# Altium schematic sheet 3_IO.SchDoc
size A3; SheetNumber: 4; SheetTotal: 13
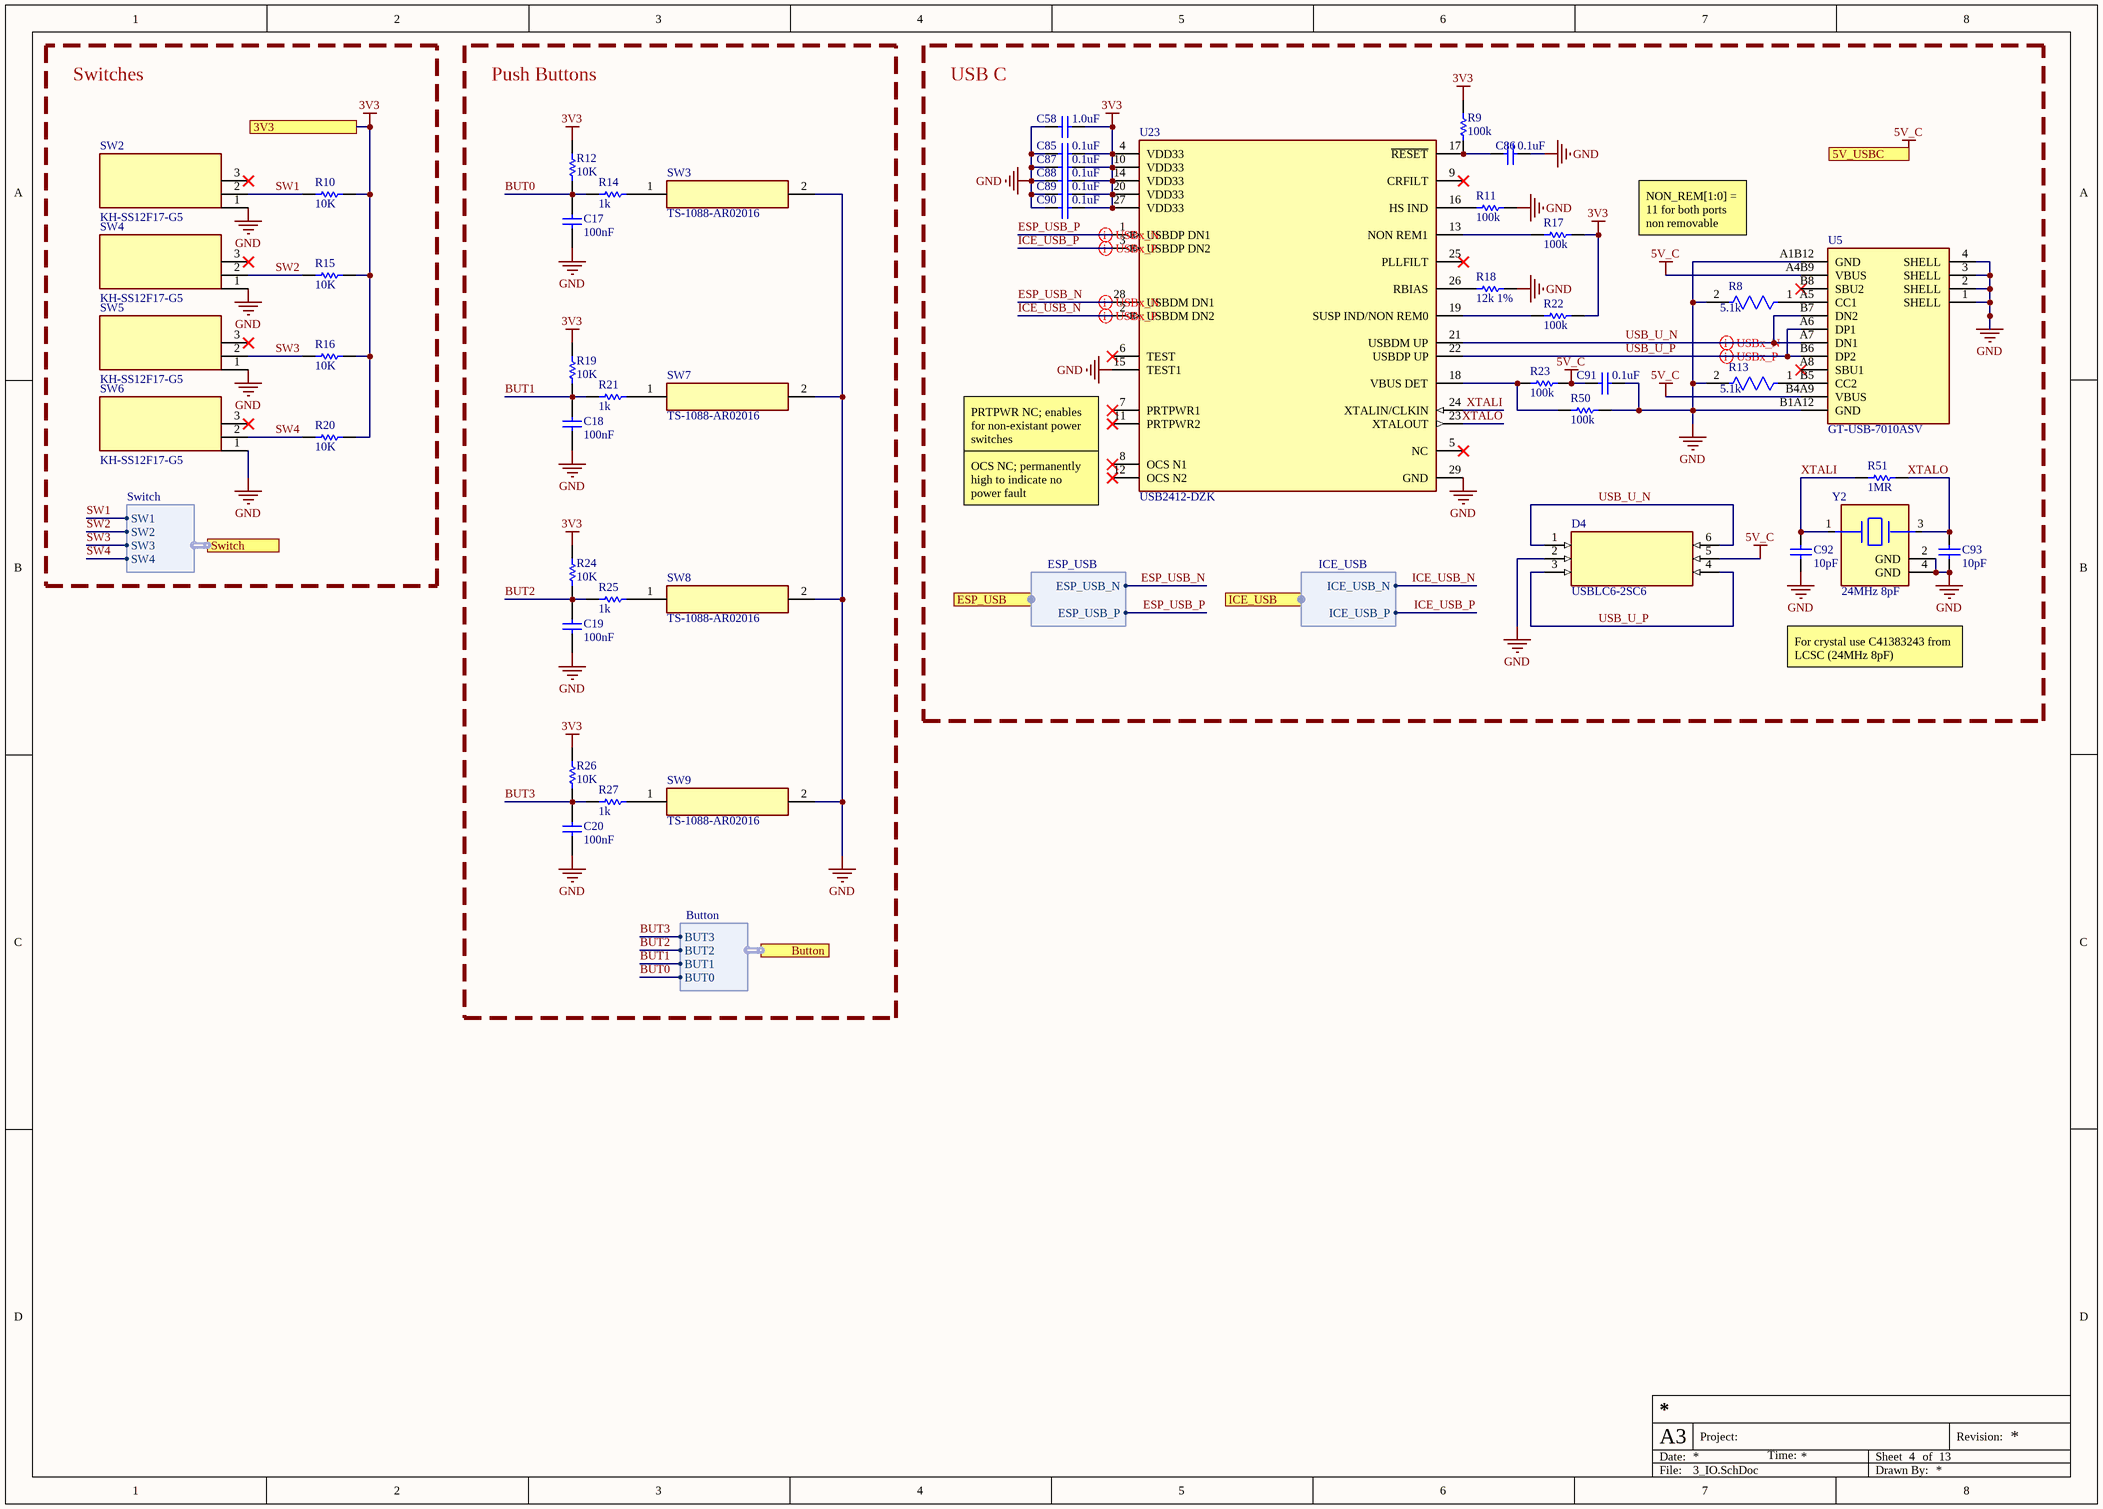
[diagram p0: 3_IO.SchDoc]

## Parts
C17  value 100nF  [CAP0603R]  (hidden comment: EMF107B7104KAHT)
C18  value 100nF  [CAP0603R]  (hidden comment: EMF107B7104KAHT)
C19  value 100nF  [CAP0603R]  (hidden comment: EMF107B7104KAHT)
C20  value 100nF  [CAP0603R]  (hidden comment: EMF107B7104KAHT)
C58  1.0uF  [CAPC1608X90X35ML15T15]
C85  0.1uF  [CAPC1608X90X35ML15T15]
C86  0.1uF  [CAPC1608X90X35ML15T15]
C87  0.1uF  [CAPC1608X90X35ML15T15]
C88  0.1uF  [CAPC1608X90X35ML15T15]
C89  0.1uF  [CAPC1608X90X35ML15T15]
C90  0.1uF  [CAPC1608X90X35ML15T15]
C91  0.1uF  [CAPC1608X90X35ML15T15]
C92  10pF  [CAPC1608X90X35ML15T15]
C93  10pF  [CAPC1608X90X35ML15T15]
D4  USBLC6-2SC6  [SOT-23-6_L2.9-W1.6-P0.95-LS2.8-BL]
R8  5.1k  [FP-MCT0603-IPC_B]
R9  100k  [RESC1609X55X30NL10T20]
R10  10K  [RESC1609X55X30NL10T20]
R11  100k  [RESC1609X55X30NL10T20]
R12  10K  [RESC1609X55X30NL10T20]
R13  5.1k  [FP-MCT0603-IPC_B]
R14  1k  [RESC1609X55X30NL10T20]
R15  10K  [RESC1609X55X30NL10T20]
R16  10K  [RESC1609X55X30NL10T20]
R17  100k  [RESC1609X55X30NL10T20]
R18  12k 1%  [RESC1609X55X30NL10T20]
R19  10K  [RESC1609X55X30NL10T20]
R20  10K  [RESC1609X55X30NL10T20]
R21  1k  [RESC1609X55X30NL10T20]
R22  100k  [RESC1609X55X30NL10T20]
R23  100k  [RESC1609X55X30NL10T20]
R24  10K  [RESC1609X55X30NL10T20]
R25  1k  [RESC1609X55X30NL10T20]
R26  10K  [RESC1609X55X30NL10T20]
R27  1k  [RESC1609X55X30NL10T20]
R50  100k  [RESC1609X55X30NL10T20]
R51  1MR  [RESC1609X55X30NL10T20]
SW2  KH-SS12F17-G5  [SW-TH_KH-SS12F17-G5]
SW3  TS-1088-AR02016  [SW-SMD_L3.9-W3.0-P4.45]
SW4  KH-SS12F17-G5  [SW-TH_KH-SS12F17-G5]
SW5  KH-SS12F17-G5  [SW-TH_KH-SS12F17-G5]
SW6  KH-SS12F17-G5  [SW-TH_KH-SS12F17-G5]
SW7  TS-1088-AR02016  [SW-SMD_L3.9-W3.0-P4.45]
SW8  TS-1088-AR02016  [SW-SMD_L3.9-W3.0-P4.45]
SW9  TS-1088-AR02016  [SW-SMD_L3.9-W3.0-P4.45]
U5  GT-USB-7010ASV  [USB-C-SMD_G-SWITCH_GT-USB-7010ASV]
U23  USB2412-DZK  [FP-USB2412-DZK-MFG]
Y2  24MHz 8pF  [FP-TSX-3225-MFG]

## Blocks framed on the sheet
Switches: R10 R15 R16 R20 SW2 SW4-SW6
Push Buttons: C17-C20 R12 R14 R19 R21 R24-R27 SW3 SW7-SW9
USB C: C58 C85-C93 D4 R8 R9 R11 R13 R17 R18 R22 R23 R50 R51 U5 U23 Y2

## Ports
3V3, 5V_USBC, Button (harness Button), ESP_USB (harness ESP_USB), ICE_USB (harness ICE_USB), Switch (harness Switch)

## Harnesses
Switch: SW1, SW2, SW3, SW4
Button: BUT0, BUT2, BUT3, BUT1
ICE_USB: ICE_USB_N, ICE_USB_P
ESP_USB: ESP_USB_N, ESP_USB_P

## Nets
3V3: C58.1 C85.1 C87.1 C88.1 C89.1 C90.1 R9.2 R10.1 R12.2 R15.1 R16.1 R17.1 R19.2 R20.1 R22.1 R24.2 R26.2 U23.4(VDD33) U23.10(VDD33) U23.14(VDD33) U23.20(VDD33) U23.27(VDD33) ; port 3V3
5V_C: C91.2 D4.5 R23.1 U5.A4B9(VBUS) U5.B4A9(VBUS) ; port 5V_USBC
GND: C17.1 C18.1 C19.1 C20.1 C58.2 C85.2 C86.1 C87.2 C88.2 C89.2 C90.2 C91.1 C92.2 C93.2 D4.2 R8.2 R11.1 R13.2 R18.1 R50.1 SW2.1 SW3.2 SW4.1 SW5.1 SW6.1 SW7.2 SW8.2 SW9.2 U5.1(SHELL) U5.2(SHELL) U5.3(SHELL) U5.4(SHELL) U5.A1B12(GND) U5.B1A12(GND) U23.15(TEST1) U23.29(GND) Y2.2(GND) Y2.4(GND)
BUT0: C17.2 R12.1 R14.2 ; port Button.BUT0
BUT1: C18.2 R19.1 R21.2 ; port Button.BUT1
BUT2: C19.2 R24.1 R25.2 ; port Button.BUT2
BUT3: C20.2 R26.1 R27.2 ; port Button.BUT3
ESP_USB_N: U23.28(USBDM_DN1) ; port ESP_USB.ESP_USB_N
ESP_USB_P: U23.1(USBDP_DN1) ; port ESP_USB.ESP_USB_P
ICE_USB_N: U23.2(USBDM_DN2) ; port ICE_USB.ICE_USB_N
ICE_USB_P: U23.3(USBDP_DN2) ; port ICE_USB.ICE_USB_P
SW1: R10.2 SW2.2 ; port Switch.SW1
SW2: R15.2 SW4.2 ; port Switch.SW2
SW3: R16.2 SW5.2 ; port Switch.SW3
SW4: R20.2 SW6.2 ; port Switch.SW4
USB_U_N: D4.1 D4.6 U5.A7(DN1) U5.B7(DN2) U23.21(USBDM_UP)
USB_U_P: D4.3 D4.4 U5.A6(DP1) U5.B6(DP2) U23.22(USBDP_UP)
XTALI: C92.1 R51.2 U23.24(XTALIN/CLKIN) Y2.1
XTALO: C93.1 R51.1 U23.23(XTALOUT) Y2.3
NetC86_2: C86.2 R9.1 U23.17(~{RESET})
NetR8_1: R8.1 U5.A5(CC1)
NetR11_2: R11.2 U23.16(HS_IND)
NetR13_1: R13.1 U5.B5(CC2)
NetR14_1: R14.1 SW3.1
NetR17_2: R17.2 U23.13(NON_REM1)
NetR18_2: R18.2 U23.26(RBIAS)
NetR21_1: R21.1 SW7.1
NetR22_2: R22.2 U23.19(SUSP_IND/NON_REM0)
NetR23_2: R23.2 R50.2 U23.18(VBUS_DET)
NetR25_1: R25.1 SW8.1
NetR27_1: R27.1 SW9.1

Not connected (* = marked no-connect by the designer): SW2 3*; SW4 3*; SW5 3*; SW6 3*; U5 A8(SBU1)* B8(SBU2)*; U23 5(NC)* 6(TEST)* 7(PRTPWR1)* 8(OCS_N1)* 9(CRFILT)* 11(PRTPWR2)* 12(OCS_N2)* 25(PLLFILT)*

## Layout directives
differential pair: ESP_USB_N, ESP_USB_P, ICE_USB_N, ICE_USB_P, USB_U_N, USB_U_P

## Notes on the sheet
- NON_REM[1:0] = 11 for both ports non removable
- (near U23) PRTPWR NC; enables for non-existant power switches
- (near U23) OCS NC; permanently high to indicate no power fault
- For crystal use C41383243 from LCSC (24MHz 8pF)
- Date:
- A3
- Project:
- Time:
- Sheet
- of
- Revision:
- File:
- Drawn By:

## Library data of the parts
C17-C20 = CMP-024-000573-8: CAP, MLCC, 0603/1608, 16V, X7R,; Manufacturer: Taiyo Yuden; Tolerance: 10%; Case/Package: 0603 (1608 Metric); Supplier 1: Digi-Key; Max Operating Temperature: 125°C; PN: EMF107B7104KAHT; Temperature Coefficient: X7R; ComponentLink1URL: https://ds.yuden.co.jp/TYCOMPAS/ut/detail?pn=EMF107B7104KAHT&u=M; Min Operating Temperature: -55°C; ComponentLink1Description: Datasheet; Supplier Part Number 1: 587-6558-1-ND; Rating: AEC-Q200
C58 C85-C93 = CMP-2006-04205-1: Manufacturer: AVX Interconnect / Elco; Part Number: 06034D226MAT2A
D4 = USBLC6-2SC6: Polarity:Unidirectional Reverse Stand-Off Voltage (Vrwm):5.25V Clamping Voltage:17V Peak Pulse Current (Ipp):5A Voltage - Breakdown:6V Reverse Leakage Current (Ir):150nA Number of Channels:2 Operating Temperature:-40℃~+125℃ Operating Temperature:-40℃~+125; Manufacturer: ST(意法半导体); Reverse Stand-Off Voltage (Vrwm): 5.25V; Clamping Voltage: 17V; Peak Pulse Current (Ipp): 5A; Voltage - Breakdown: 6V; Reverse Leakage Current (Ir): 150nA; Number of Channels: 2; level of protection: IEC 61000-4-2; Type: ESD; Junction Capacitance: 3.5pF; LCSC Part Name: 单向ESD; Supplier Part: C7519; Manufacturer Part: USBLC6-2SC6; Supplier Footprint: SOT-23-6L; JLCPCB Part Class: Extended Part; Datasheet: https://item.szlcsc.com/datasheet/USBLC6-2SC6/7996.html; Supplier: LCSC; Polarity: Unidirectional; Operating Temperature: -40℃~+125℃
R8 R13 = CMP-02407-010205-1: RES SMD 100 OHM 1% 1/8W 0603; Resistance: 5.1kR; Tolerance: 0.1%; Temperature Coefficient: 25ppm/°C; Max Operating Temperature: 125°C; Radiation Hardening: No; Composition: Thin Film; Height: 450um; Lead Free: Lead Free; Contact Plating: Tin; Length: 1.55mm; Width: 850um; Case/Package: 0603; Min Operating Temperature: -55°C
R9-R12 R14-R27 R50 R51 = CMP-2000-03692-1: Manufacturer: Vishay Dale; Part Number: TNPW060310K0BEEN
SW2 SW4-SW6 = CMP-011-00014-1: Manufacturer: kinghelm(金航标); JLCPCB Part Class: Extended Part; Supplier Part: C5274464; LCSC Part Name: 拨动开关 KH-SS12F17-G5; Design Item ID: KH-SS12F17-G5; Manufacturer Part: KH-SS12F17-G5; Datasheet: https://atta.szlcsc.com/upload/public/pdf/source/20221118/A394A3D39A10FBA52FA26B90A9AAE8C2.pdf; Supplier Footprint: 插件; Source: EasyEDA.schlib
SW3 SW7-SW9 = TS-1088-AR02016: Circuit:SPST Actuator Style:Round Button Operating Force:1.6N Mounting Type:Surface Mount,Vertical Length:3.9mm Width:3mm Switch Height:2mm with Bracket:Without Bracket Contact Current:50mA Voltage Rating:12V Actuator/Cap Color:Black With Lamp:- IP Rating; Manufacturer: XUNPU(讯普); Circuit: SPST; Operating Force: 1.6N; Switch Height: 2mm; Contact Current: 50mA; Voltage Rating: 12V; Actuator/Cap Color: Black; Life: 100,000 cycles; LCSC Part Name: 3.9*3*2mm 立贴 轻触开关; Supplier Part: C720477; Manufacturer Part: TS-1088-AR02016; Supplier Footprint: SMD,4x3mm; JLCPCB Part Class: Basic Part; Datasheet: https://item.szlcsc.com/datasheet/TS-1088-AR02016/763484.html; Supplier: LCSC; Actuator Style: Round Button; Mounting Type: Surface Mount,Vertical; Length: 3.9mm; Width: 3mm; with Bracket: Without Bracket; Termination Style: SMD(SMT) Tab; Operating Temperature: -30℃~+80℃
U5 = CMP-019-000005-1: Connector Type:Type-C Protocol Standard:USB 2.0 Gender:Female Mounting Type:Surface Mount, Right Angle Number of Contacts:16P Number of Ports:1 Current Rating-Power:3A Voltage Rating:24V Connect-Disconnect Life:10,000 cycles Center Height:1.68mm Length:7.; Manufacturer: G-Switch(品赞); Gender: Female; Current Rating-Power: 3A; Detection color: Black; Connector Type: Type-C; Center Height: 1.68mm; Number of Contacts: 16P; Protocol Standard: USB 2.0; Voltage Rating: 24V; Number of Ports: 1; Supplier Part: C2988369; LCSC Part Name: Type-C 母 卧贴; Datasheet: https://item.szlcsc.com/datasheet/GT-USB-7010ASV/3445595.html; Manufacturer Part: GT-USB-7010ASV; JLCPCB Part Class: Extended Part; Supplier Footprint: SMD; Source: EasyEDA.schlib; Mounting Type: Surface Mount, Right Angle; Design Item ID: GT-USB-7010ASV; Connect-Disconnect Life: 10,000 cycles; Length: 7.35mm; Operating Temperature: -40℃~+85℃
U23 = CMP-06284-000049-1: IC USB 2.0 HS HUB CTRLR 28QFN; Number of Transceivers: 1; Data Rate: 480Mbps; Number of Ports: 2; ESD Protection: Yes; Operating Supply Voltage: 3.3V; Max Supply Voltage: 3.6V; Min Supply Voltage: 3V; Min Operating Temperature: 0°C; Packaging: Tray; Lead Free: Lead Free; Interface: USB; REACH SVHC: No SVHC; Length: 5.1mm; Series: -; Case/Package: QFN; Width: 5.1mm; Number of Pins: 28; Mount: Surface Mount; Package Quantity: 490; Height: 0.95mm; Radiation Hardening: No; Max Operating Temperature: 70°C
Y2 = CMP-36405-000018-1: CRYSTAL 24.0000MHZ 9PF SMD; ESR (Equivalent Series Resistance): 40R; Frequency Stability: 20ppm; Tolerance: 10ppm; Drive Level: 200uW; Min Operating Temperature: -40°C; RoHS Compliant: Yes; Width: 2.5mm; Max Operating Temperature: 105°C; Package Quantity: 250; Load Capacitance: 9pF; Mount: Surface Mount; Lead Free: Lead Free; Height: 0.024inch; Depth: 2.5mm; Frequency: 24MHz; Packaging: Tape and Reel; Series: TSX-3225; Weight: 0.000564oz; Number of Pins: 4; Termination: SMD/SMT; Case/Package: SMD/SMT; Length: 3.2mm; Frequency Tolerance: 10ppm